# EAGLE schematic combined (EAGLE 9.6.2)
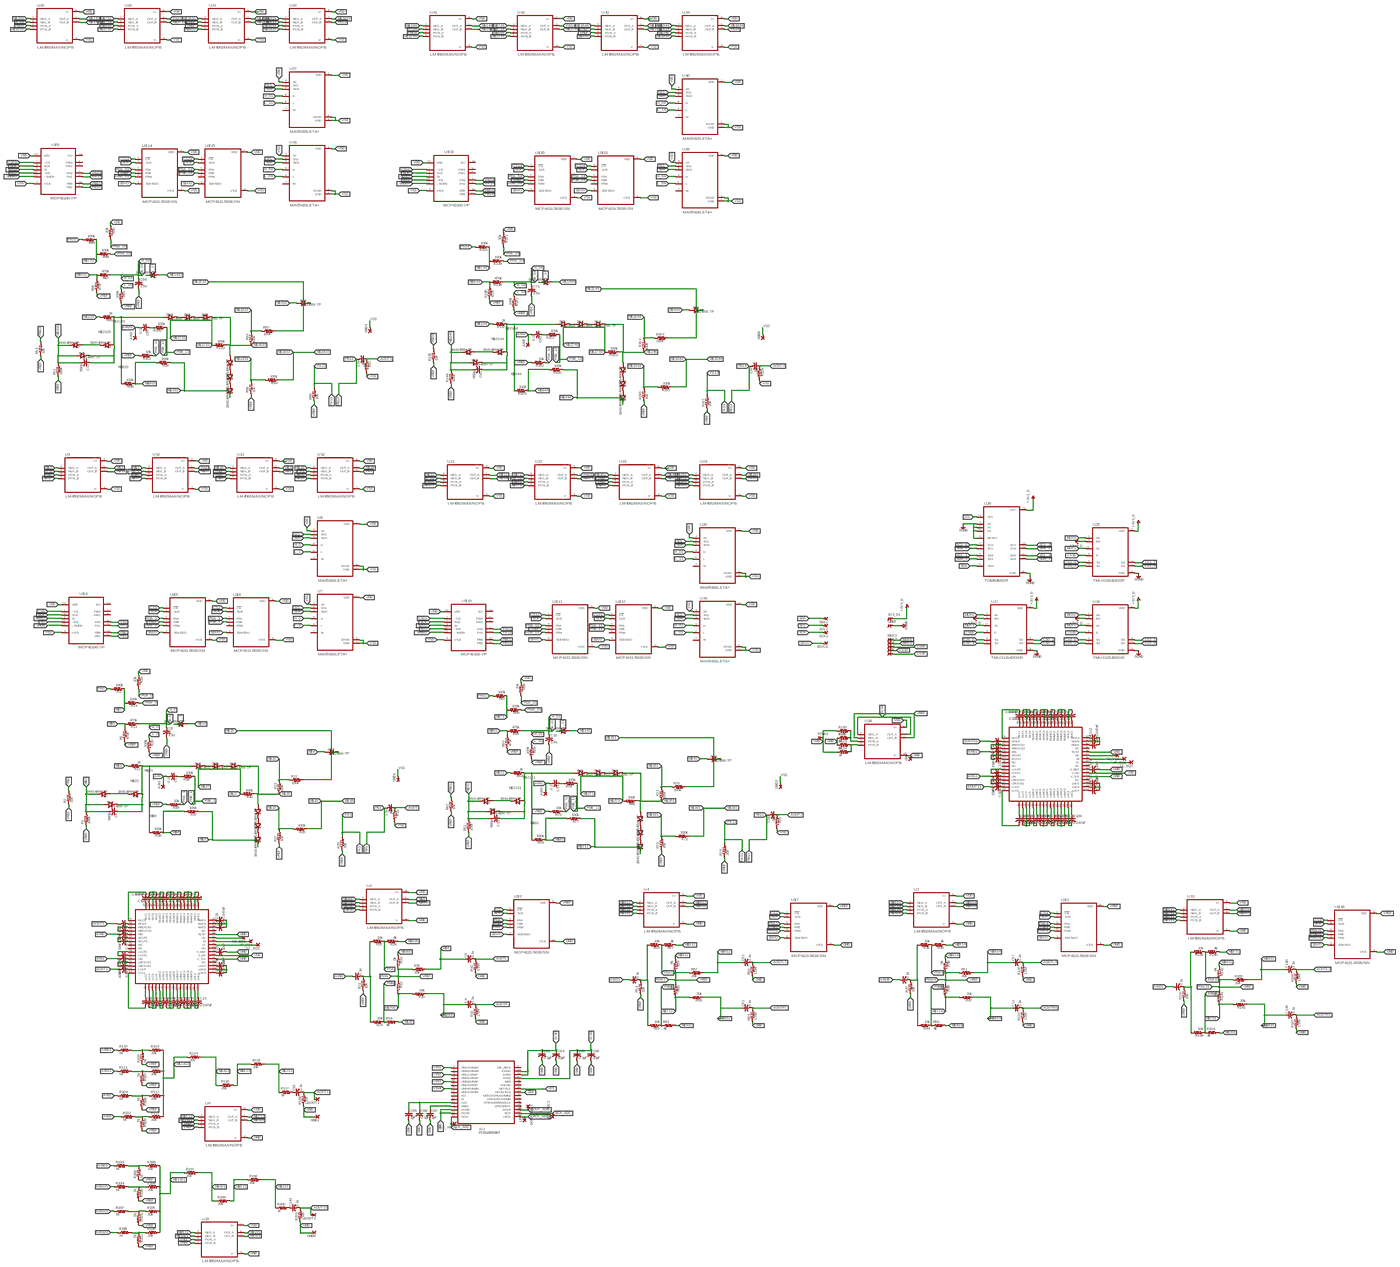
[diagram p0: schematic, sheet 1, overview]
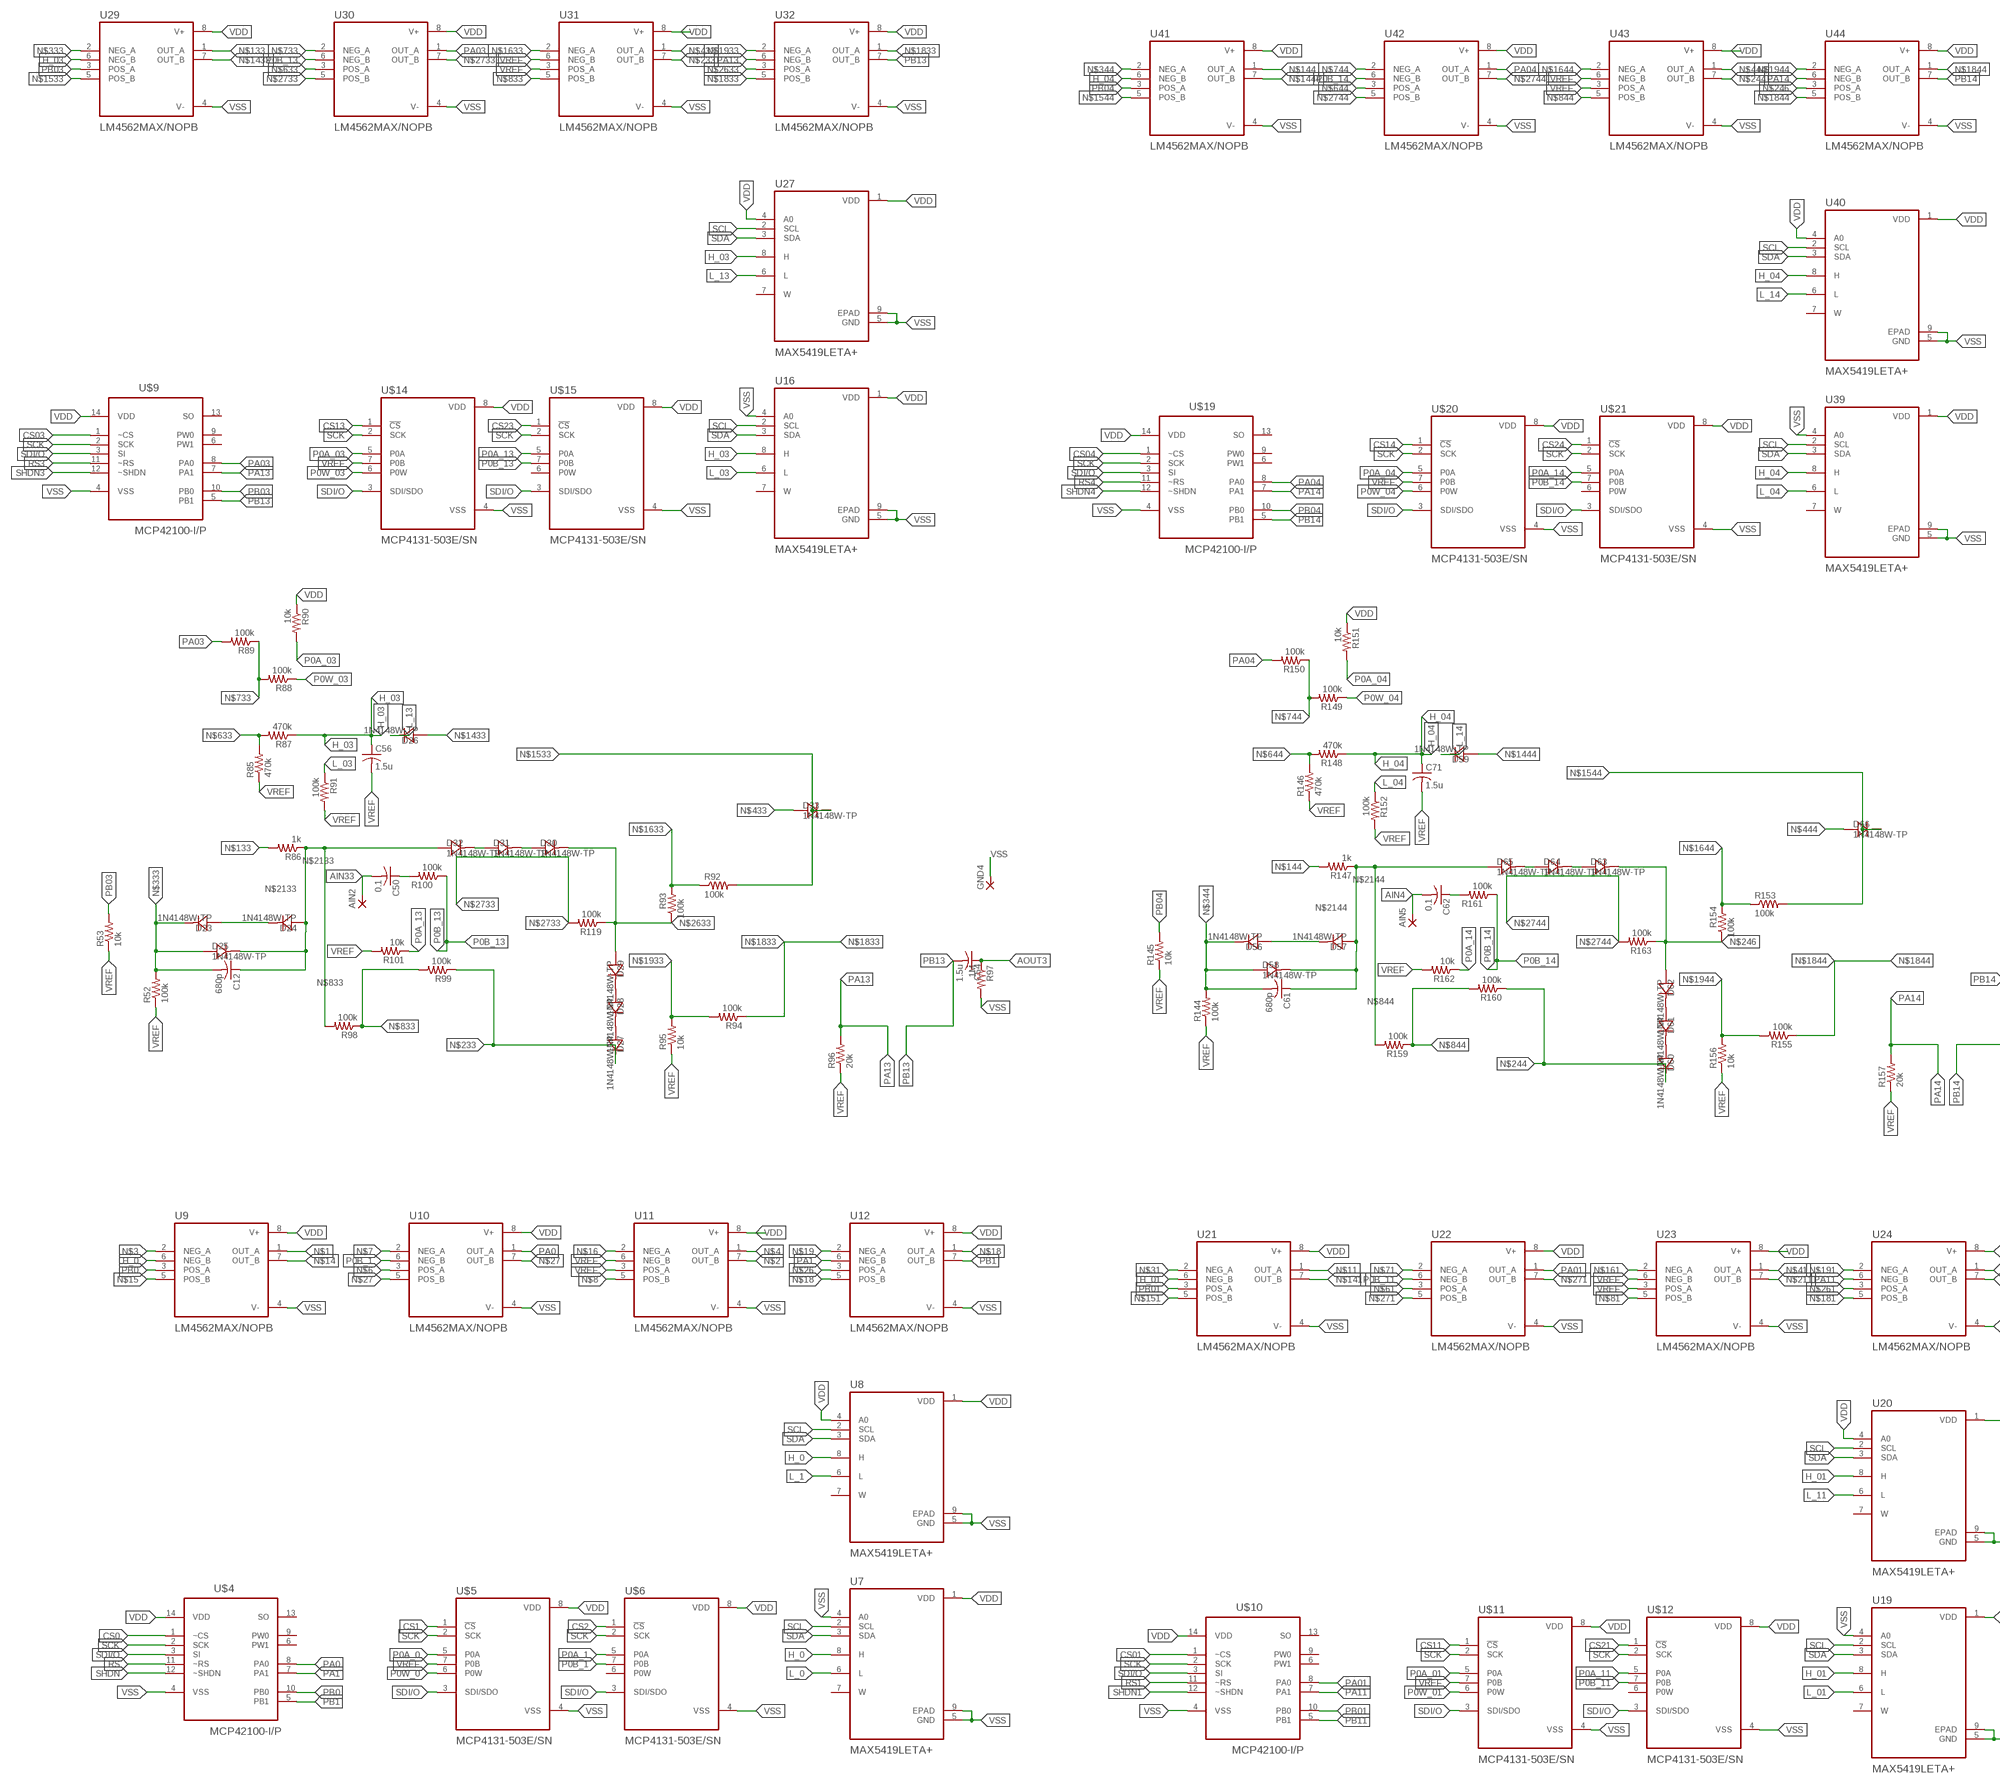
[diagram p1: schematic, sheet 1, part 1 of 4]
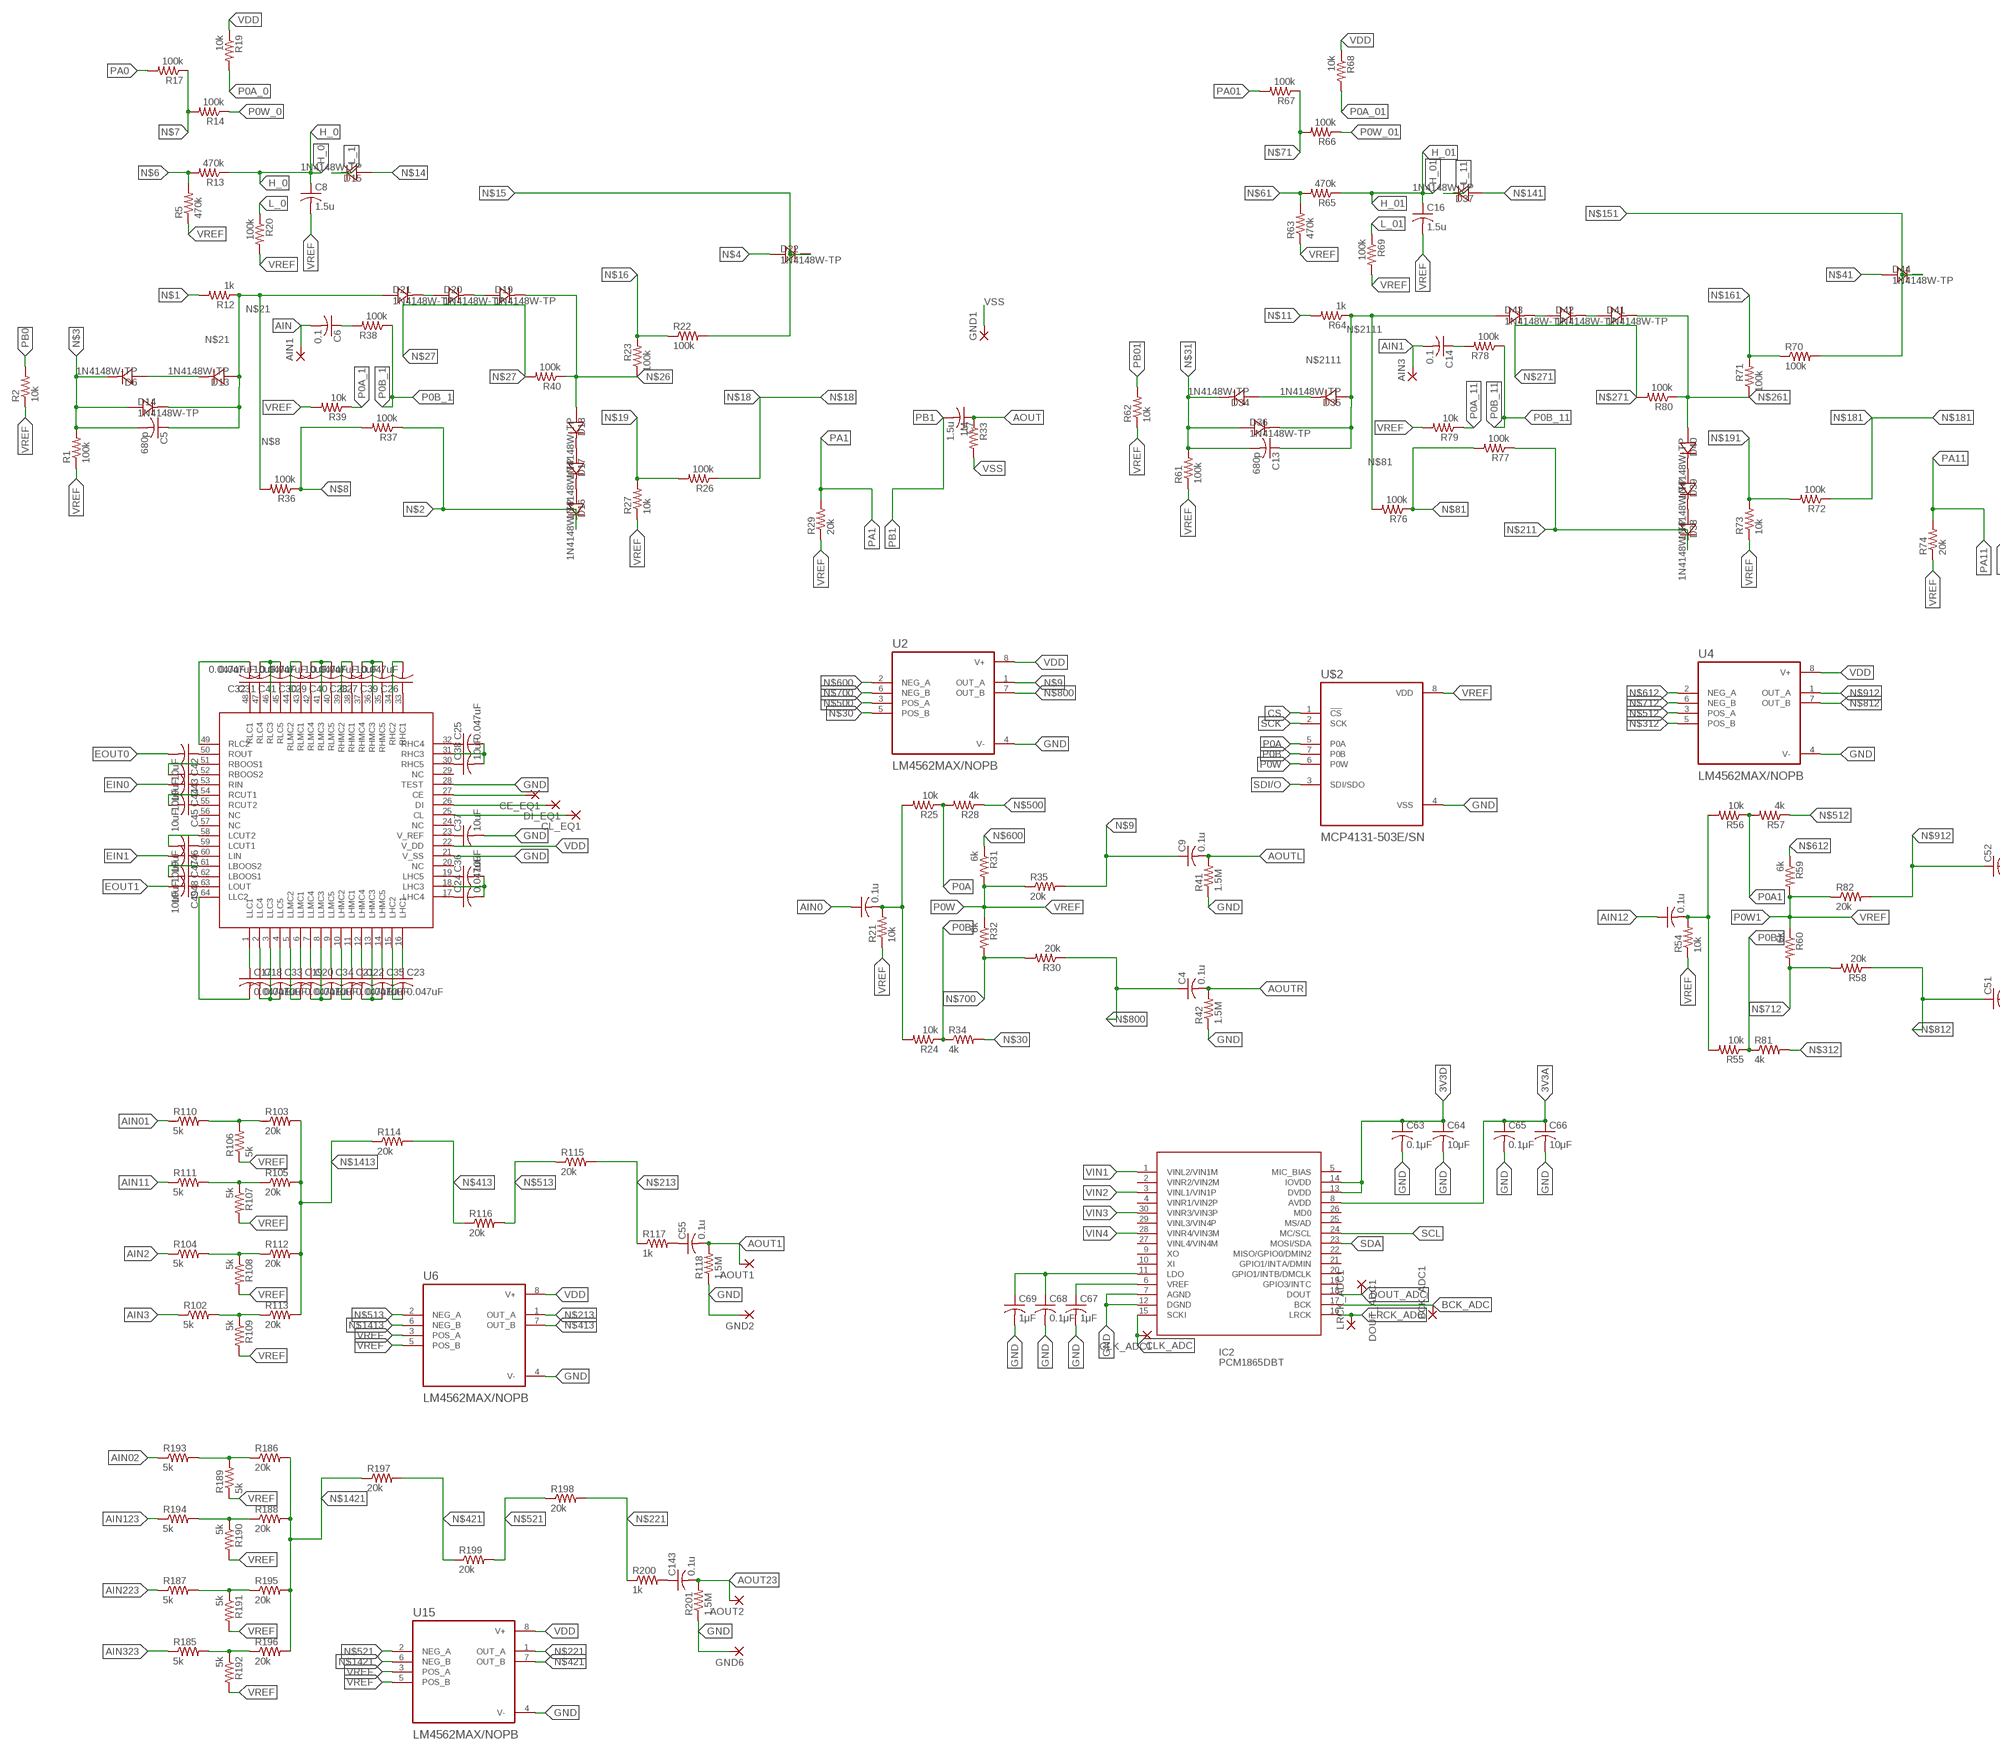
[diagram p2: schematic, sheet 1, part 2 of 4]
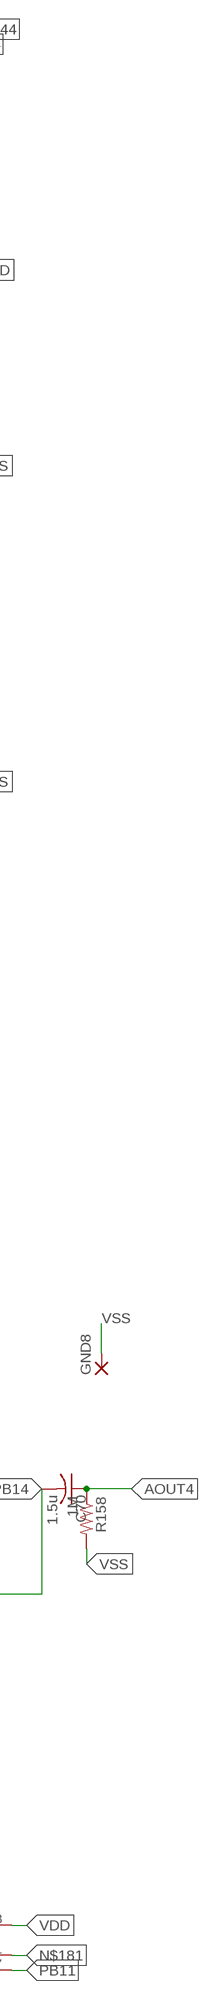
[diagram p3: schematic, sheet 1, part 3 of 4]
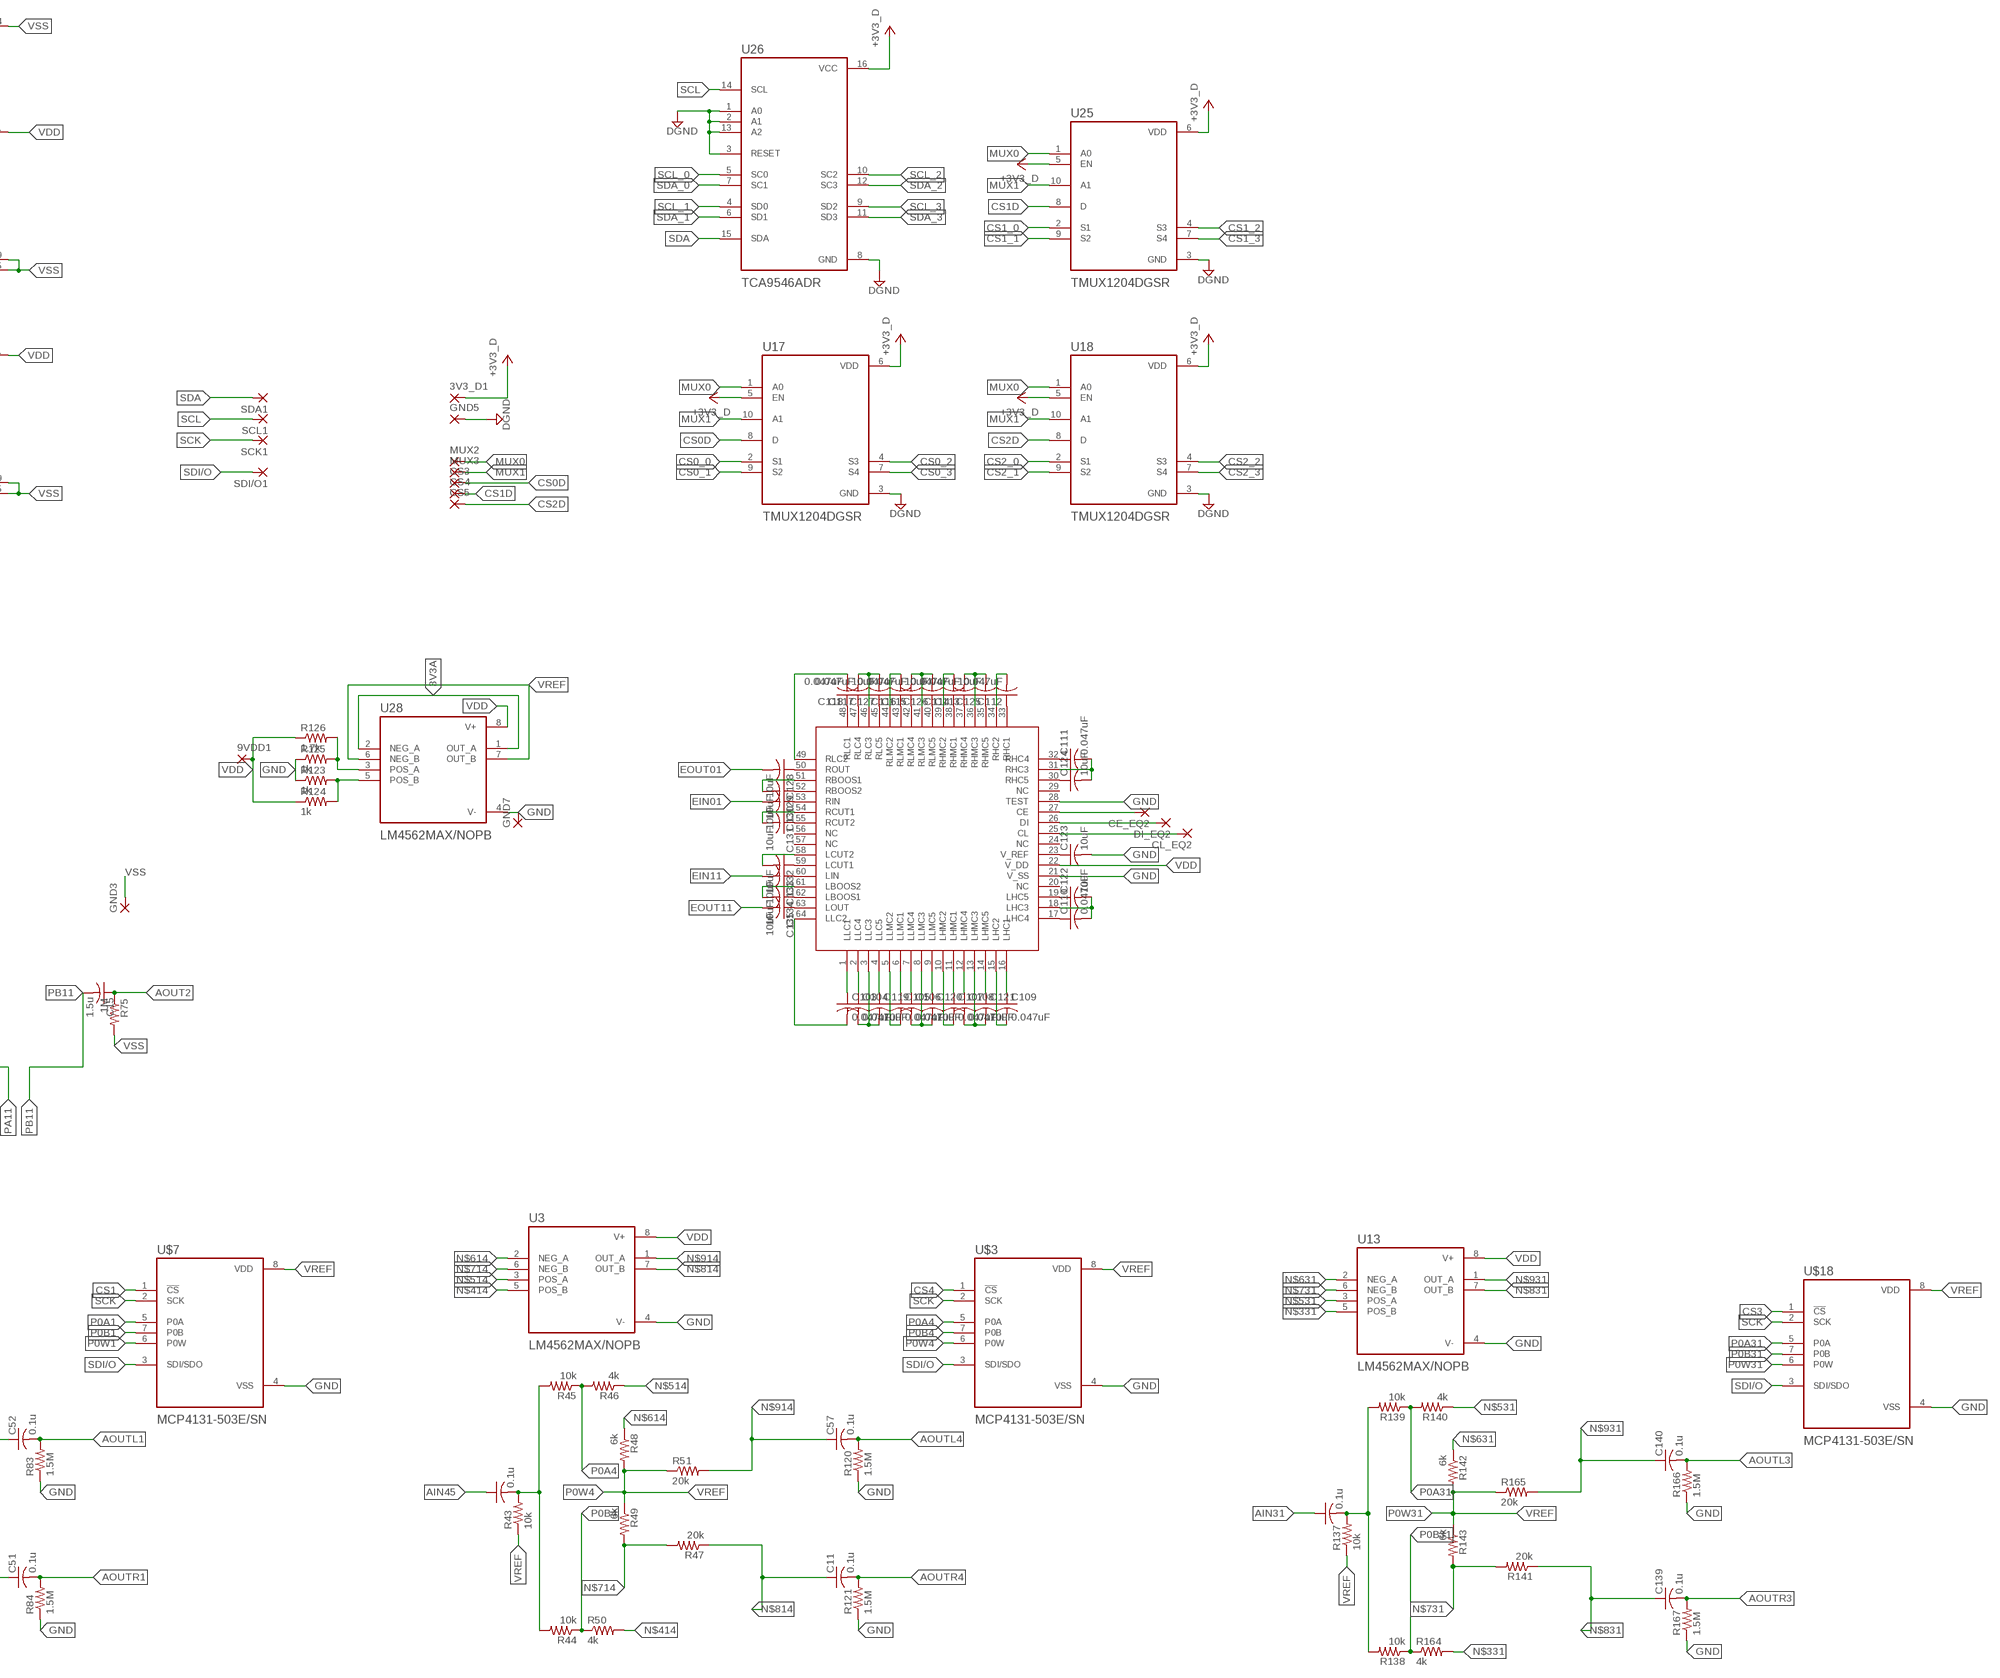
[diagram p4: schematic, sheet 1, part 4 of 4]

## Parts
3V3_D1  SMD2  [SMD1,27-2,54]
9VDD1  SMD2  [SMD1,27-2,54]
AIN1  SMD5  [SMD2,54-5,08]
AIN2  SMD5  [SMD2,54-5,08]
AIN3  SMD5  [SMD2,54-5,08]
AIN5  SMD5  [SMD2,54-5,08]
AOUT1  SMD5  [SMD2,54-5,08]
AOUT2  SMD5  [SMD2,54-5,08]
BCK_ADC1  SMD2  [SMD1,27-2,54]
C4  0.1u  C-USC0402  [C0402]
C5  680p  C-USC0402  [C0402]
C6  0.1  C-USC0402  [C0402]
C7  1.5u  C-USC0402  [C0402]
C8  1.5u  C-USC0402  [C0402]
C9  0.1u  C-USC0402  [C0402]
C10  0.1u  C-USC0402  [C0402]
C11  0.1u  C-USC0402  [C0402]
C12  680p  C-USC0402  [C0402]
C13  680p  C-USC0402  [C0402]
C14  0.1  C-USC0402  [C0402]
C15  1.5u  C-USC0402  [C0402]
C16  1.5u  C-USC0402  [C0402]
C17  0.047uF  C-USC0402  [C0402]
C18  0.047uF  C-USC0402  [C0402]
C19  0.047uF  C-USC0402  [C0402]
C20  0.047uF  C-USC0402  [C0402]
C21  0.047uF  C-USC0402  [C0402]
C22  0.047uF  C-USC0402  [C0402]
C23  0.047uF  C-USC0402  [C0402]
C24  0.047uF  C-USC0402  [C0402]
C25  0.047uF  C-USC0402  [C0402]
C26  0.047uF  C-USC0402  [C0402]
C27  0.047uF  C-USC0402  [C0402]
C28  0.047uF  C-USC0402  [C0402]
C29  0.047uF  C-USC0402  [C0402]
C30  0.047uF  C-USC0402  [C0402]
C31  0.047uF  C-USC0402  [C0402]
C32  0.047uF  C-USC0402  [C0402]
C33  10uF  C-USC0402  [C0402]
C34  10uF  C-USC0402  [C0402]
C35  10uF  C-USC0402  [C0402]
C36  10uF  C-USC0402  [C0402]
C37  10uF  C-USC0402  [C0402]
C38  10uF  C-USC0402  [C0402]
C39  10uF  C-USC0402  [C0402]
C40  10uF  C-USC0402  [C0402]
C41  10uF  C-USC0402  [C0402]
C42  10uF  C-USC0402  [C0402]
C43  10uF  C-USC0402  [C0402]
C44  10uF  C-USC0402  [C0402]
C45  10uF  C-USC0402  [C0402]
C46  10uF  C-USC0402  [C0402]
C47  10uF  C-USC0402  [C0402]
C48  10uF  C-USC0402  [C0402]
C49  10uF  C-USC0402  [C0402]
C50  0.1  C-USC0402  [C0402]
C51  0.1u  C-USC0402  [C0402]
C52  0.1u  C-USC0402  [C0402]
C53  0.1u  C-USC0402  [C0402]
C54  1.5u  C-USC0402  [C0402]
C55  0.1u  C-USC0402  [C0402]
C56  1.5u  C-USC0402  [C0402]
C57  0.1u  C-USC0402  [C0402]
C58  0.1u  C-USC0402  [C0402]
C61  680p  C-USC0402  [C0402]
C62  0.1  C-USC0402  [C0402]
C63  0.1μF  C-USC0402  [C0402]
C64  10μF  C-USC0402  [C0402]
C65  0.1μF  C-USC0402  [C0402]
C66  10μF  C-USC0402  [C0402]
C67  1μF  C-USC0402  [C0402]
C68  0.1μF  C-USC0402  [C0402]
C69  1μF  C-USC0402  [C0402]
C70  1.5u  C-USC0402  [C0402]
C71  1.5u  C-USC0402  [C0402]
C103  0.047uF  C-USC0402  [C0402]
C104  0.047uF  C-USC0402  [C0402]
C105  0.047uF  C-USC0402  [C0402]
C106  0.047uF  C-USC0402  [C0402]
C107  0.047uF  C-USC0402  [C0402]
C108  0.047uF  C-USC0402  [C0402]
C109  0.047uF  C-USC0402  [C0402]
C110  0.047uF  C-USC0402  [C0402]
C111  0.047uF  C-USC0402  [C0402]
C112  0.047uF  C-USC0402  [C0402]
C113  0.047uF  C-USC0402  [C0402]
C114  0.047uF  C-USC0402  [C0402]
C115  0.047uF  C-USC0402  [C0402]
C116  0.047uF  C-USC0402  [C0402]
C117  0.047uF  C-USC0402  [C0402]
C118  0.047uF  C-USC0402  [C0402]
C119  10uF  C-USC0402  [C0402]
C120  10uF  C-USC0402  [C0402]
C121  10uF  C-USC0402  [C0402]
C122  10uF  C-USC0402  [C0402]
C123  10uF  C-USC0402  [C0402]
C124  10uF  C-USC0402  [C0402]
C125  10uF  C-USC0402  [C0402]
C126  10uF  C-USC0402  [C0402]
C127  10uF  C-USC0402  [C0402]
C128  10uF  C-USC0402  [C0402]
C129  10uF  C-USC0402  [C0402]
C130  10uF  C-USC0402  [C0402]
C131  10uF  C-USC0402  [C0402]
C132  10uF  C-USC0402  [C0402]
C133  10uF  C-USC0402  [C0402]
C134  10uF  C-USC0402  [C0402]
C135  10uF  C-USC0402  [C0402]
C139  0.1u  C-USC0402  [C0402]
C140  0.1u  C-USC0402  [C0402]
C141  0.1u  C-USC0402  [C0402]
C143  0.1u  C-USC0402  [C0402]
CE_EQ1  SMD2  [SMD1,27-2,54]
CE_EQ2  SMD2  [SMD1,27-2,54]
CL_EQ1  SMD2  [SMD1,27-2,54]
CL_EQ2  SMD2  [SMD1,27-2,54]
CLK_ADC1  SMD2  [SMD1,27-2,54]
CS3  SMD2  [SMD1,27-2,54]
CS4  SMD2  [SMD1,27-2,54]
CS5  SMD2  [SMD1,27-2,54]
D6  1N4148W-TP  [SOD123]
D13  1N4148W-TP  [SOD123]
D14  1N4148W-TP  [SOD123]
D15  1N4148W-TP  [SOD123]
D16  1N4148W-TP  [SOD123]
D17  1N4148W-TP  [SOD123]
D18  1N4148W-TP  [SOD123]
D19  1N4148W-TP  [SOD123]
D20  1N4148W-TP  [SOD123]
D21  1N4148W-TP  [SOD123]
D22  1N4148W-TP  [SOD123]
D23  1N4148W-TP  [SOD123]
D24  1N4148W-TP  [SOD123]
D25  1N4148W-TP  [SOD123]
D26  1N4148W-TP  [SOD123]
D27  1N4148W-TP  [SOD123]
D28  1N4148W-TP  [SOD123]
D29  1N4148W-TP  [SOD123]
D30  1N4148W-TP  [SOD123]
D31  1N4148W-TP  [SOD123]
D32  1N4148W-TP  [SOD123]
D33  1N4148W-TP  [SOD123]
D34  1N4148W-TP  [SOD123]
D35  1N4148W-TP  [SOD123]
D36  1N4148W-TP  [SOD123]
D37  1N4148W-TP  [SOD123]
D38  1N4148W-TP  [SOD123]
D39  1N4148W-TP  [SOD123]
D40  1N4148W-TP  [SOD123]
D41  1N4148W-TP  [SOD123]
D42  1N4148W-TP  [SOD123]
D43  1N4148W-TP  [SOD123]
D44  1N4148W-TP  [SOD123]
D56  1N4148W-TP  [SOD123]
D57  1N4148W-TP  [SOD123]
D58  1N4148W-TP  [SOD123]
D59  1N4148W-TP  [SOD123]
D60  1N4148W-TP  [SOD123]
D61  1N4148W-TP  [SOD123]
D62  1N4148W-TP  [SOD123]
D63  1N4148W-TP  [SOD123]
D64  1N4148W-TP  [SOD123]
D65  1N4148W-TP  [SOD123]
D66  1N4148W-TP  [SOD123]
DI_EQ1  SMD2  [SMD1,27-2,54]
DI_EQ2  SMD2  [SMD1,27-2,54]
DOUT_ADC1  SMD2  [SMD1,27-2,54]
GND1  SMD5  [SMD2,54-5,08]
GND2  SMD5  [SMD2,54-5,08]
GND3  SMD5  [SMD2,54-5,08]
GND4  SMD5  [SMD2,54-5,08]
GND5  SMD2  [SMD1,27-2,54]
GND6  SMD5  [SMD2,54-5,08]
GND7  SMD2  [SMD1,27-2,54]
GND8  SMD5  [SMD2,54-5,08]
IC2  PCM1865DBT  [TSSOP-30]
LRCK_ADC1  SMD2  [SMD1,27-2,54]
MUX2  SMD2  [SMD1,27-2,54]
MUX3  SMD2  [SMD1,27-2,54]
R1  100k  R-US_R0402  [R0402]
R2  10k  R-US_R0402  [R0402]
R5  470k  R-US_R0402  [R0402]
R12  1k  R-US_R0402  [R0402]
R13  470k  R-US_R0402  [R0402]
R14  100k  R-US_R0402  [R0402]
R17  100k  R-US_R0402  [R0402]
R19  10k  R-US_R0402  [R0402]
R20  100k  R-US_R0402  [R0402]
R21  10k  R-US_R0402  [R0402]
R22  100k  R-US_R0402  [R0402]
R23  100k  R-US_R0402  [R0402]
R24  10k  R-US_R0402  [R0402]
R25  10k  R-US_R0402  [R0402]
R26  100k  R-US_R0402  [R0402]
R27  10k  R-US_R0402  [R0402]
R28  4k  R-US_R0402  [R0402]
R29  20k  R-US_R0402  [R0402]
R30  20k  R-US_R0402  [R0402]
R31  6k  R-US_R0402  [R0402]
R32  6k  R-US_R0402  [R0402]
R33  1M  R-US_R0402  [R0402]
R34  4k  R-US_R0402  [R0402]
R35  20k  R-US_R0402  [R0402]
R36  100k  R-US_R0402  [R0402]
R37  100k  R-US_R0402  [R0402]
R38  100k  R-US_R0402  [R0402]
R39  10k  R-US_R0402  [R0402]
R40  100k  R-US_R0402  [R0402]
R41  1.5M  R-US_R0402  [R0402]
R42  1.5M  R-US_R0402  [R0402]
R43  10k  R-US_R0402  [R0402]
R44  10k  R-US_R0402  [R0402]
R45  10k  R-US_R0402  [R0402]
R46  4k  R-US_R0402  [R0402]
R47  20k  R-US_R0402  [R0402]
R48  6k  R-US_R0402  [R0402]
R49  6k  R-US_R0402  [R0402]
R50  4k  R-US_R0402  [R0402]
R51  20k  R-US_R0402  [R0402]
R52  100k  R-US_R0402  [R0402]
R53  10k  R-US_R0402  [R0402]
R54  10k  R-US_R0402  [R0402]
R55  10k  R-US_R0402  [R0402]
R56  10k  R-US_R0402  [R0402]
R57  4k  R-US_R0402  [R0402]
R58  20k  R-US_R0402  [R0402]
R59  6k  R-US_R0402  [R0402]
R60  6k  R-US_R0402  [R0402]
R61  100k  R-US_R0402  [R0402]
R62  10k  R-US_R0402  [R0402]
R63  470k  R-US_R0402  [R0402]
R64  1k  R-US_R0402  [R0402]
R65  470k  R-US_R0402  [R0402]
R66  100k  R-US_R0402  [R0402]
R67  100k  R-US_R0402  [R0402]
R68  10k  R-US_R0402  [R0402]
R69  100k  R-US_R0402  [R0402]
R70  100k  R-US_R0402  [R0402]
R71  100k  R-US_R0402  [R0402]
R72  100k  R-US_R0402  [R0402]
R73  10k  R-US_R0402  [R0402]
R74  20k  R-US_R0402  [R0402]
R75  1M  R-US_R0402  [R0402]
R76  100k  R-US_R0402  [R0402]
R77  100k  R-US_R0402  [R0402]
R78  100k  R-US_R0402  [R0402]
R79  10k  R-US_R0402  [R0402]
R80  100k  R-US_R0402  [R0402]
R81  4k  R-US_R0402  [R0402]
R82  20k  R-US_R0402  [R0402]
R83  1.5M  R-US_R0402  [R0402]
R84  1.5M  R-US_R0402  [R0402]
R85  470k  R-US_R0402  [R0402]
R86  1k  R-US_R0402  [R0402]
R87  470k  R-US_R0402  [R0402]
R88  100k  R-US_R0402  [R0402]
R89  100k  R-US_R0402  [R0402]
R90  10k  R-US_R0402  [R0402]
R91  100k  R-US_R0402  [R0402]
R92  100k  R-US_R0402  [R0402]
R93  100k  R-US_R0402  [R0402]
R94  100k  R-US_R0402  [R0402]
R95  10k  R-US_R0402  [R0402]
R96  20k  R-US_R0402  [R0402]
R97  1M  R-US_R0402  [R0402]
R98  100k  R-US_R0402  [R0402]
R99  100k  R-US_R0402  [R0402]
R100  100k  R-US_R0402  [R0402]
R101  10k  R-US_R0402  [R0402]
R102  5k  R-US_R0402  [R0402]
R103  20k  R-US_R0402  [R0402]
R104  5k  R-US_R0402  [R0402]
R105  20k  R-US_R0402  [R0402]
R106  5k  R-US_R0402  [R0402]
R107  5k  R-US_R0402  [R0402]
R108  5k  R-US_R0402  [R0402]
R109  5k  R-US_R0402  [R0402]
R110  5k  R-US_R0402  [R0402]
R111  5k  R-US_R0402  [R0402]
R112  20k  R-US_R0402  [R0402]
R113  20k  R-US_R0402  [R0402]
R114  20k  R-US_R0402  [R0402]
R115  20k  R-US_R0402  [R0402]
R116  20k  R-US_R0402  [R0402]
R117  1k  R-US_R0402  [R0402]
R118  1.5M  R-US_R0402  [R0402]
R119  100k  R-US_R0402  [R0402]
R120  1.5M  R-US_R0402  [R0402]
R121  1.5M  R-US_R0402  [R0402]
R123  1k  R-US_R0402  [R0402]
R124  1k  R-US_R0402  [R0402]
R125  1k  R-US_R0402  [R0402]
R126  1.7k  R-US_R0402  [R0402]
R137  10k  R-US_R0402  [R0402]
R138  10k  R-US_R0402  [R0402]
R139  10k  R-US_R0402  [R0402]
R140  4k  R-US_R0402  [R0402]
R141  20k  R-US_R0402  [R0402]
R142  6k  R-US_R0402  [R0402]
R143  6k  R-US_R0402  [R0402]
R144  100k  R-US_R0402  [R0402]
R145  10k  R-US_R0402  [R0402]
R146  470k  R-US_R0402  [R0402]
R147  1k  R-US_R0402  [R0402]
R148  470k  R-US_R0402  [R0402]
R149  100k  R-US_R0402  [R0402]
R150  100k  R-US_R0402  [R0402]
R151  10k  R-US_R0402  [R0402]
R152  100k  R-US_R0402  [R0402]
R153  100k  R-US_R0402  [R0402]
R154  100k  R-US_R0402  [R0402]
R155  100k  R-US_R0402  [R0402]
R156  10k  R-US_R0402  [R0402]
R157  20k  R-US_R0402  [R0402]
R158  1M  R-US_R0402  [R0402]
R159  100k  R-US_R0402  [R0402]
R160  100k  R-US_R0402  [R0402]
R161  100k  R-US_R0402  [R0402]
R162  10k  R-US_R0402  [R0402]
R163  100k  R-US_R0402  [R0402]
R164  4k  R-US_R0402  [R0402]
R165  20k  R-US_R0402  [R0402]
R166  1.5M  R-US_R0402  [R0402]
R167  1.5M  R-US_R0402  [R0402]
R185  5k  R-US_R0402  [R0402]
R186  20k  R-US_R0402  [R0402]
R187  5k  R-US_R0402  [R0402]
R188  20k  R-US_R0402  [R0402]
R189  5k  R-US_R0402  [R0402]
R190  5k  R-US_R0402  [R0402]
R191  5k  R-US_R0402  [R0402]
R192  5k  R-US_R0402  [R0402]
R193  5k  R-US_R0402  [R0402]
R194  5k  R-US_R0402  [R0402]
R195  20k  R-US_R0402  [R0402]
R196  20k  R-US_R0402  [R0402]
R197  20k  R-US_R0402  [R0402]
R198  20k  R-US_R0402  [R0402]
R199  20k  R-US_R0402  [R0402]
R200  1k  R-US_R0402  [R0402]
R201  1.5M  R-US_R0402  [R0402]
SCK1  SMD2  [SMD1,27-2,54]
SCL1  SMD2  [SMD1,27-2,54]
SDA1  SMD2  [SMD1,27-2,54]
SDI/O1  SMD2  [SMD1,27-2,54]
U2  LM4562MAX/NOPB  [SOIC127P599X175-8N]
U3  LM4562MAX/NOPB  [SOIC127P599X175-8N]
U4  LM4562MAX/NOPB  [SOIC127P599X175-8N]
U6  LM4562MAX/NOPB  [SOIC127P599X175-8N]
U7  MAX5419LETA+  [SON65P300X300X80-9N]
U8  MAX5419LETA+  [SON65P300X300X80-9N]
U9  LM4562MAX/NOPB  [SOIC127P599X175-8N]
U10  LM4562MAX/NOPB  [SOIC127P599X175-8N]
U11  LM4562MAX/NOPB  [SOIC127P599X175-8N]
U12  LM4562MAX/NOPB  [SOIC127P599X175-8N]
U13  LM4562MAX/NOPB  [SOIC127P599X175-8N]
U15  LM4562MAX/NOPB  [SOIC127P599X175-8N]
U16  MAX5419LETA+  [SON65P300X300X80-9N]
U17  TMUX1204DGSR  [SOP50P490X110-10N]
U18  TMUX1204DGSR  [SOP50P490X110-10N]
U19  MAX5419LETA+  [SON65P300X300X80-9N]
U20  MAX5419LETA+  [SON65P300X300X80-9N]
U21  LM4562MAX/NOPB  [SOIC127P599X175-8N]
U22  LM4562MAX/NOPB  [SOIC127P599X175-8N]
U23  LM4562MAX/NOPB  [SOIC127P599X175-8N]
U24  LM4562MAX/NOPB  [SOIC127P599X175-8N]
U25  TMUX1204DGSR  [SOP50P490X110-10N]
U26  TCA9546ADR  [SOIC127P600X175-16N]
U27  MAX5419LETA+  [SON65P300X300X80-9N]
U28  LM4562MAX/NOPB  [SOIC127P599X175-8N]
U29  LM4562MAX/NOPB  [SOIC127P599X175-8N]
U30  LM4562MAX/NOPB  [SOIC127P599X175-8N]
U31  LM4562MAX/NOPB  [SOIC127P599X175-8N]
U32  LM4562MAX/NOPB  [SOIC127P599X175-8N]
U39  MAX5419LETA+  [SON65P300X300X80-9N]
U40  MAX5419LETA+  [SON65P300X300X80-9N]
U41  LM4562MAX/NOPB  [SOIC127P599X175-8N]
U42  LM4562MAX/NOPB  [SOIC127P599X175-8N]
U43  LM4562MAX/NOPB  [SOIC127P599X175-8N]
U44  LM4562MAX/NOPB  [SOIC127P599X175-8N]
U$2  MCP4131-503E/SN  [SOIC127P599X175-8N]
U$3  MCP4131-503E/SN  [SOIC127P599X175-8N]
U$4  MCP42100-I/P  [DIP254P762X432-14]
U$5  MCP4131-503E/SN  [SOIC127P599X175-8N]
U$6  MCP4131-503E/SN  [SOIC127P599X175-8N]
U$7  MCP4131-503E/SN  [SOIC127P599X175-8N]
U$9  MCP42100-I/P  [DIP254P762X432-14]
U$10  MCP42100-I/P  [DIP254P762X432-14]
U$11  MCP4131-503E/SN  [SOIC127P599X175-8N]
U$12  MCP4131-503E/SN  [SOIC127P599X175-8N]
U$13  LC75281E  [QFP80P1720X1720X270-64N]
U$14  MCP4131-503E/SN  [SOIC127P599X175-8N]
U$15  MCP4131-503E/SN  [SOIC127P599X175-8N]
U$16  LC75281E  [QFP80P1720X1720X270-64N]
U$18  MCP4131-503E/SN  [SOIC127P599X175-8N]
U$19  MCP42100-I/P  [DIP254P762X432-14]
U$20  MCP4131-503E/SN  [SOIC127P599X175-8N]
U$21  MCP4131-503E/SN  [SOIC127P599X175-8N]

## Nets
3V3A: C65.1 C66.1 IC2.8(AVDD) U28.1(OUT_A) U28.2(NEG_A)
3V3D: C63.1 C64.1 IC2.13(DVDD) IC2.14(IOVDD)
+3V3: 3V3_D1.1(P) U17.5(EN) U17.6(VDD) U18.5(EN) U18.6(VDD) U25.5(EN) U25.6(VDD) U26.16(VCC) ; supply symbol labelled +3V3_D
AIN: AIN1.1(P) C6.2
AIN0: C10.1
AIN1: AIN3.1(P) C14.2
AIN01: R110.1
AIN2: R104.1
AIN02: R193.1
AIN3: R102.1
AIN4: AIN5.1(P) C62.2
AIN11: R111.1
AIN12: C53.1
AIN31: C141.1
AIN33: AIN2.1(P) C50.2
AIN45: C58.1
AIN123: R194.1
AIN223: R187.1
AIN323: R185.1
AOUT: C7.1 R33.1
AOUT1: AOUT1.1(P) C55.2 R118.2
AOUT2: C15.1 R75.1
AOUT3: C54.1 R97.1
AOUT4: C70.1 R158.1
AOUT23: AOUT2.1(P) C143.2 R201.2
AOUTL: C9.2 R41.2
AOUTL1: C52.2 R83.2
AOUTL3: C140.2 R166.2
AOUTL4: C57.2 R120.2
AOUTR: C4.2 R42.2
AOUTR1: C51.2 R84.2
AOUTR3: C139.2 R167.2
AOUTR4: C11.2 R121.2
BCK_ADC: BCK_ADC1.1(P) IC2.17(BCK)
CLK_ADC: CLK_ADC1.1(P) IC2.15(SCKI)
CS: U$2.1(!CS)
CS0: U$4.1(~CS)
CS0_0: U17.2(S1)
CS0_1: U17.9(S2)
CS0_2: U17.4(S3)
CS0_3: U17.7(S4)
CS0D: CS3.1(P) U17.8(D)
CS1: U$5.1(!CS) U$7.1(!CS)
CS01: U$10.1(~CS)
CS1_0: U25.2(S1)
CS1_1: U25.9(S2)
CS1_2: U25.4(S3)
CS1_3: U25.7(S4)
CS1D: CS4.1(P) U25.8(D)
CS2: U$6.1(!CS)
CS2_0: U18.2(S1)
CS2_1: U18.9(S2)
CS2_2: U18.4(S3)
CS2_3: U18.7(S4)
CS2D: CS5.1(P) U18.8(D)
CS03: U$9.1(~CS)
CS3: U$18.1(!CS)
CS04: U$19.1(~CS)
CS4: U$3.1(!CS)
CS11: U$11.1(!CS)
CS13: U$14.1(!CS)
CS14: U$20.1(!CS)
CS21: U$12.1(!CS)
CS23: U$15.1(!CS)
CS24: U$21.1(!CS)
DGND: GND5.1(P) U17.3(GND) U18.3(GND) U25.3(GND) U26.1(A0) U26.2(A1) U26.3(RESET) U26.8(GND) U26.13(A2)
DOUT_ADC: DOUT_ADC1.1(P) IC2.18(DOUT)
EIN0 [ANALOG]: C44.2
EIN1 [ANALOG]: C47.2
EIN01: C130.2
EIN11: C133.2
EOUT0 [ANALOG]: C42.2
EOUT1 [ANALOG]: C49.2
EOUT01: C128.2
EOUT11: C135.2
EQ1_CE1: CE_EQ1.1(P) U$13.27(CE)
EQ1_CE2: CE_EQ2.1(P) U$16.27(CE)
EQ1_CL1: CL_EQ1.1(P) U$13.25(CL)
EQ1_CL2: CL_EQ2.1(P) U$16.25(CL)
EQ1_DI1: DI_EQ1.1(P) U$13.26(DI)
EQ1_DI2: DI_EQ2.1(P) U$16.26(DI)
GND: C37.2 C63.2 C64.2 C65.2 C66.2 C67.2 C68.2 C69.2 C123.2 GND2.1(P) GND6.1(P) GND7.1(P) IC2.7(AGND) IC2.12(DGND) R41.1 R42.1 R83.1 R84.1 R118.1 R120.1 R121.1 R123.1 R125.1 R166.1 R167.1 R201.1 U2.4(V-) U3.4(V-) U4.4(V-) U6.4(V-) U13.4(V-) U15.4(V-) U28.4(V-) U$2.4(VSS) U$3.4(VSS) U$7.4(VSS) U$13.21(V_SS) U$13.28(TEST) U$16.21(V_SS) U$16.28(TEST) U$18.4(VSS)
H_0: C8.1 R13.1 U7.8(H) U8.8(H) U9.6(NEG_B)
H_01: C16.1 R65.1 U19.8(H) U20.8(H) U21.6(NEG_B)
H_03: C56.1 R87.1 U16.8(H) U27.8(H) U29.6(NEG_B)
H_04: C71.1 R148.1 U39.8(H) U40.8(H) U41.6(NEG_B)
L_0: R20.1 U7.6(L)
L_1: D15.C U8.6(L)
L_01: R69.1 U19.6(L)
L_03: R91.1 U16.6(L)
L_04: R152.1 U39.6(L)
L_11: D37.C U20.6(L)
L_13: D26.C U27.6(L)
L_14: D59.C U40.6(L)
LRCK_ADC: IC2.16(LRCK) LRCK_ADC1.1(P)
MUX0: MUX2.1(P) U17.1(A0) U18.1(A0) U25.1(A0)
MUX1: MUX3.1(P) U17.10(A1) U18.10(A1) U25.10(A1)
N$1: D6.A D13.C R12.2 U9.1(OUT_A)
N$2: D16.C D17.A D18.C R37.1 U11.7(OUT_B)
N$3: C5.2 D6.C D14.A D16.A D17.C R1.2 U9.2(NEG_A)
N$4: C6.1 D22.A R38.2 U11.1(OUT_A)
N$5: D20.A D21.C
N$6: D19.A D20.C R5.2 R13.2 U10.3(POS_A)
N$7: R14.2 R17.1 U10.2(NEG_A)
N$8: R36.1 R37.2 U11.5(POS_B)
N$9: C9.1 R35.2 U2.1(OUT_A)
N$10: C10.2 R21.2 R24.2 R25.2
N$11: R64.2 U21.1(OUT_A)
N$13: D34.A D35.C
N$14: D15.A U9.7(OUT_B)
N$15: D22.C R22.2 U9.5(POS_B)
N$16: R22.1 R23.2 U11.2(NEG_A)
N$17: D42.A D43.C
N$18: R26.1 U12.1(OUT_A) U12.5(POS_B)
N$19: R26.2 R27.2 U12.2(NEG_A)
N$20: C58.2 R43.2 R44.2 R45.2
N$21: C5.1 D13.A D14.C D21.A R12.1 R36.2
N$22 [ANALOG]: C19.1 U$13.6(LLMC1)
N$23 [ANALOG]: C20.1 U$13.7(LLMC4)
N$26: D18.A D19.C R23.1 R40.1 U12.3(POS_A)
N$27: R40.2 U10.5(POS_B) U10.7(OUT_B)
N$28 [ANALOG]: C23.1 U$13.16(LHC1)
N$29 [ANALOG]: C24.1 U$13.17(LHC4)
N$30: R34.2 U2.5(POS_B)
N$31: C13.2 D34.C D36.A R61.2 U21.2(NEG_A)
N$33 [ANALOG]: C25.1 U$13.32(RHC4)
N$34 [ANALOG]: C26.1 U$13.33(RHC1)
N$35 [ANALOG]: C27.1 U$13.37(RHMC4)
N$36 [ANALOG]: C28.1 U$13.38(RHMC1)
N$37 [ANALOG]: C29.1 U$13.42(RLMC4)
N$38 [ANALOG]: C30.1 U$13.43(RLMC1)
N$39 [ANALOG]: C31.1 U$13.47(RLC4)
N$40 [ANALOG]: C32.1 U$13.48(RLC1)
N$41: D44.A U23.1(OUT_A)
N$42 [ANALOG]: C18.2 C33.2 U$13.3(LLC3)
N$43 [ANALOG]: C33.1 U$13.4(LLC5)
N$44 [ANALOG]: C34.1 U$13.9(LLMC5)
N$45 [ANALOG]: C35.1 U$13.14(LHMC5)
N$46 [ANALOG]: C36.1 U$13.19(LHC5)
N$47 [ANALOG]: C37.1 U$13.23(V_REF)
N$48 [ANALOG]: C38.1 U$13.30(RHC5)
N$49 [ANALOG]: C39.1 U$13.35(RHMC5)
N$50 [ANALOG]: C40.1 U$13.40(RLMC5)
N$51 [ANALOG]: C41.1 U$13.45(RLC5)
N$52 [ANALOG]: C42.1 U$13.50(ROUT)
N$53 [ANALOG]: C43.1 U$13.52(RBOOS2)
N$54 [ANALOG]: C44.1 U$13.53(RIN)
N$55 [ANALOG]: C45.1 U$13.55(RCUT2)
N$56 [ANALOG]: C46.1 U$13.59(LCUT1)
N$57 [ANALOG]: C47.1 U$13.60(LIN)
N$58 [ANALOG]: C48.1 U$13.62(LBOOS1)
N$59 [ANALOG]: C49.1 U$13.63(LOUT)
N$60 [ANALOG]: C19.2 U$13.5(LLMC2)
N$61: R63.2 R65.2 U22.3(POS_A)
N$62 [ANALOG]: C21.2 U$13.10(LHMC2)
N$63 [ANALOG]: C22.2 C35.2 U$13.13(LHMC3)
N$64 [ANALOG]: C23.2 U$13.15(LHC2)
N$65 [ANALOG]: C24.2 C36.2 U$13.18(LHC3)
N$66 [ANALOG]: C25.2 C38.2 U$13.31(RHC3)
N$67 [ANALOG]: C26.2 U$13.34(RHC2)
N$68 [ANALOG]: C27.2 C39.2 U$13.36(RHMC3)
N$69 [ANALOG]: C28.2 U$13.39(RHMC2)
N$70 [ANALOG]: C29.2 C40.2 U$13.41(RLMC3)
N$71: R66.2 R67.1 U22.2(NEG_A)
N$72 [ANALOG]: C31.2 C41.2 U$13.46(RLC3)
N$73 [ANALOG]: C32.2 U$13.49(RLC2)
N$74 [ANALOG]: C43.2 U$13.51(RBOOS1)
N$75 [ANALOG]: C45.2 U$13.54(RCUT1)
N$76 [ANALOG]: C46.2 U$13.58(LCUT2)
N$77 [ANALOG]: C48.2 U$13.61(LBOOS2)
N$78 [ANALOG]: C18.1 U$13.2(LLC4)
N$80: C55.1 R117.2
N$81: R76.1 R77.2 U23.5(POS_B)
N$82: R103.1 R106.2 R110.2
N$83: R102.2 R109.1 R113.1
N$84: R104.2 R108.1 R112.1
N$85: R105.1 R107.1 R111.2
N$86: D23.A D24.C
N$87: D28.A D29.C
N$88: C67.1 IC2.6(VREF)
N$89: C68.1 C69.1 IC2.11(LDO)
N$90: D27.A D28.C
N$91: C50.1 R100.2
N$92: R125.2 R126.2 U28.3(POS_A)
N$93: R123.2 R124.2 U28.5(POS_B)
N$94: D31.A D32.C
N$95: D30.A D31.C
N$99: C103.1 U$16.1(LLC1)
N$100: C105.1 U$16.6(LLMC1)
N$101: C106.1 U$16.7(LLMC4)
N$102: D56.A D57.C
N$103: D61.A D62.C
N$104: D60.A D61.C
N$105: C62.1 R161.2
N$106: D64.A D65.C
N$107: D63.A D64.C
N$108: C107.1 U$16.11(LHMC1)
N$109: C108.1 U$16.12(LHMC4)
N$110: C109.1 U$16.16(LHC1)
N$111: C110.1 U$16.17(LHC4)
N$112: C111.1 U$16.32(RHC4)
N$113: C112.1 U$16.33(RHC1)
N$114: C113.1 U$16.37(RHMC4)
N$115: C114.1 U$16.38(RHMC1)
N$116: C115.1 U$16.42(RLMC4)
N$117: C116.1 U$16.43(RLMC1)
N$118: C117.1 U$16.47(RLC4)
N$119: C118.1 U$16.48(RLC1)
N$120: C103.2 U$16.64(LLC2)
N$121: C104.2 C119.2 U$16.3(LLC3)
N$122: C119.1 U$16.4(LLC5)
N$124: C120.1 U$16.9(LLMC5)
N$131: C121.1 U$16.14(LHMC5)
N$132: C122.1 U$16.19(LHC5)
N$133: R86.2 U29.1(OUT_A)
N$135: C123.1 U$16.23(V_REF)
N$136: C124.1 U$16.30(RHC5)
N$137: C125.1 U$16.35(RHMC5)
N$138: C126.1 U$16.40(RLMC5)
N$139: C127.1 U$16.45(RLC5)
N$140: C128.1 U$16.50(ROUT)
N$141: D37.A U21.7(OUT_B)
N$142: D39.A D40.C
N$143: C129.1 U$16.52(RBOOS2)
N$144: R147.2 U41.1(OUT_A)
N$145: C130.1 U$16.53(RIN)
N$146: C131.1 U$16.55(RCUT2)
N$147: C132.1 U$16.59(LCUT1)
N$148: C133.1 U$16.60(LIN)
N$149: C134.1 U$16.62(LBOOS1)
N$150: C135.1 U$16.63(LOUT)
N$151: D44.C R70.2 U21.5(POS_B)
N$152: D38.A D39.C
N$153: C105.2 U$16.5(LLMC2)
N$154: C106.2 C120.2 U$16.8(LLMC3)
N$155: C107.2 U$16.10(LHMC2)
N$156: C108.2 C121.2 U$16.13(LHMC3)
N$157: C109.2 U$16.15(LHC2)
N$158: C110.2 C122.2 U$16.18(LHC3)
N$159: C111.2 C124.2 U$16.31(RHC3)
N$160: C112.2 U$16.34(RHC2)
N$161: R70.1 R71.2 U23.2(NEG_A)
N$162: C14.1 R78.2
N$163: C113.2 C125.2 U$16.36(RHMC3)
N$164: C114.2 U$16.39(RHMC2)
N$165: C115.2 C126.2 U$16.41(RLMC3)
N$166: C116.2 U$16.44(RLMC2)
N$167: C117.2 C127.2 U$16.46(RLC3)
N$168: C118.2 U$16.49(RLC2)
N$169: C129.2 U$16.51(RBOOS1)
N$170: C131.2 U$16.54(RCUT1)
N$171: C132.2 U$16.58(LCUT2)
N$172: C134.2 U$16.61(LBOOS2)
N$173: C104.1 U$16.2(LLC4)
N$175: C141.2 R137.2 R138.2 R139.2
N$181: R72.1 U24.1(OUT_A) U24.5(POS_B)
N$182: D41.A D42.C
N$191: R72.2 R73.2 U24.2(NEG_A)
N$211: D38.C R77.1 U23.7(OUT_B)
N$213: R115.2 R117.1 U6.1(OUT_A)
N$221: R198.2 R200.1 U15.1(OUT_A)
N$223: C143.1 R200.2
N$225: R186.1 R189.2 R193.2
N$226: R185.2 R192.1 R196.1
N$227: R187.2 R191.1 R195.1
N$228: R188.1 R190.1 R194.2
N$233: D27.C R99.1 U31.7(OUT_B)
N$244: D60.C R160.1 U43.7(OUT_B)
N$246: D62.A D63.C R154.1 R163.1 U44.3(POS_A)
N$261: D40.A D41.C R71.1 R80.1 U24.3(POS_A)
N$271: R80.2 U22.5(POS_B) U22.7(OUT_B)
N$312: R81.2 U4.5(POS_B)
N$331: R164.2 U13.5(POS_B)
N$333: C12.2 D23.C D25.A R52.2 U29.2(NEG_A)
N$344: C61.2 D56.C D58.A R144.2 U41.2(NEG_A)
N$411 [ANALOG]: C17.2 U$13.64(LLC2)
N$413: R114.2 R116.1 U6.7(OUT_B)
N$414: R50.2 U3.5(POS_B)
N$421: R197.2 R199.1 U15.7(OUT_B)
N$433: D33.A U31.1(OUT_A)
N$444: D66.A U43.1(OUT_A)
N$500: R28.1 U2.3(POS_A)
N$512: R57.1 U4.3(POS_A)
N$513: R115.1 R116.2 U6.2(NEG_A)
N$514: R46.1 U3.3(POS_A)
N$521: R198.1 R199.2 U15.2(NEG_A)
N$531: R140.1 U13.3(POS_A)
N$600: R31.1 U2.2(NEG_A)
N$611 [ANALOG]: C20.2 C34.2 U$13.8(LLMC3)
N$612: R59.1 U4.2(NEG_A)
N$614: R48.1 U3.2(NEG_A)
N$631: R142.1 U13.2(NEG_A)
N$633: R85.2 R87.2 U30.3(POS_A)
N$644: R146.2 R148.2 U42.3(POS_A)
N$700: R30.2 R32.2 U2.6(NEG_B)
N$711 [ANALOG]: C30.2 U$13.44(RLMC2)
N$712: R58.2 R60.2 U4.6(NEG_B)
N$714: R47.2 R49.2 U3.6(NEG_B)
N$731: R141.2 R143.2 U13.6(NEG_B)
N$733: R88.2 R89.1 U30.2(NEG_A)
N$744: R149.2 R150.1 U42.2(NEG_A)
N$800: C4.1 R30.1 U2.7(OUT_B)
N$812: C51.1 R58.1 U4.7(OUT_B)
N$814: C11.1 R47.1 U3.7(OUT_B)
N$831: C139.1 R141.1 U13.7(OUT_B)
N$833: R98.1 R99.2 U31.5(POS_B)
N$844: R159.1 R160.2 U43.5(POS_B)
N$912: C52.1 R82.2 U4.1(OUT_A)
N$914: C57.1 R51.2 U3.1(OUT_A)
N$931: C140.1 R165.2 U13.1(OUT_A)
N$1413: R103.2 R105.2 R112.2 R113.2 R114.1 U6.6(NEG_B)
N$1421: R186.2 R188.2 R195.2 R196.2 R197.1 U15.6(NEG_B)
N$1433: D26.A U29.7(OUT_B)
N$1444: D59.A U41.7(OUT_B)
N$1533: D33.C R92.2 U29.5(POS_B)
N$1544: D66.C R153.2 U41.5(POS_B)
N$1633: R92.1 R93.2 U31.2(NEG_A)
N$1644: R153.1 R154.2 U43.2(NEG_A)
N$1833: R94.1 U32.1(OUT_A) U32.5(POS_B)
N$1844: R155.1 U44.1(OUT_A) U44.5(POS_B)
N$1933: R94.2 R95.2 U32.2(NEG_A)
N$1944: R155.2 R156.2 U44.2(NEG_A)
N$2012: C53.2 R54.2 R55.2 R56.2
N$2111: C13.1 D35.A D36.C D43.A R64.1 R76.2
N$2133: C12.1 D24.A D25.C D32.A R86.1 R98.2
N$2144: C61.1 D57.A D58.C D65.A R147.1 R159.2
N$2611 [ANALOG]: C21.1 U$13.11(LHMC1)
N$2633: D29.A D30.C R93.1 R119.1 U32.3(POS_A)
N$2711 [ANALOG]: C22.1 U$13.12(LHMC4)
N$2733: R119.2 U30.5(POS_B) U30.7(OUT_B)
N$2744: R163.2 U42.5(POS_B) U42.7(OUT_B)
N$21111 [ANALOG]: C17.1 U$13.1(LLC1)
P0A: R25.1 R28.2 U$2.5(P0A)
P0A1: R56.1 R57.2 U$7.5(P0A)
P0A4: R45.1 R46.2 U$3.5(P0A)
P0A31: R139.1 R140.2 U$18.5(P0A)
P0A_0: R19.2 U$5.5(P0A)
P0A_1: R39.1 U$6.5(P0A)
P0A_01: R68.2 U$11.5(P0A)
P0A_03: R90.2 U$14.5(P0A)
P0A_04: R151.2 U$20.5(P0A)
P0A_11: R79.1 U$12.5(P0A)
P0A_13: R101.1 U$15.5(P0A)
P0A_14: R162.1 U$21.5(P0A)
P0B: R24.1 R34.1 U$2.7(P0B)
P0B1: R55.1 R81.1 U$7.7(P0B)
P0B4: R44.1 R50.1 U$3.7(P0B)
P0B31: R138.1 R164.1 U$18.7(P0B)
P0B_1: R38.1 U10.6(NEG_B) U$6.7(P0B)
P0B_11: R78.1 U22.6(NEG_B) U$12.7(P0B)
P0B_13: R100.1 U30.6(NEG_B) U$15.7(P0B)
P0B_14: R161.1 U42.6(NEG_B) U$21.7(P0B)
P0W: R31.2 R32.1 R35.1 U$2.6(P0W)
P0W1: R59.2 R60.1 R82.1 U$7.6(P0W)
P0W4: R48.2 R49.1 R51.1 U$3.6(P0W)
P0W31: R142.2 R143.1 R165.1 U$18.6(P0W)
P0W_0: R14.1 U$5.6(P0W)
P0W_01: R66.1 U$11.6(P0W)
P0W_03: R88.1 U$14.6(P0W)
P0W_04: R149.1 U$20.6(P0W)
PA0: R17.2 U10.1(OUT_A) U$4.8(PA0)
PA1: R29.2 U12.6(NEG_B) U$4.7(PA1)
PA01: R67.2 U22.1(OUT_A) U$10.8(PA0)
PA03: R89.2 U30.1(OUT_A) U$9.8(PA0)
PA04: R150.2 U42.1(OUT_A) U$19.8(PA0)
PA11: R74.2 U24.6(NEG_B) U$10.7(PA1)
PA13: R96.2 U32.6(NEG_B) U$9.7(PA1)
PA14: R157.2 U44.6(NEG_B) U$19.7(PA1)
PB0: R2.2 U9.3(POS_A) U$4.10(PB0)
PB1: C7.2 U12.7(OUT_B) U$4.5(PB1)
PB01: R62.2 U21.3(POS_A) U$10.10(PB0)
PB03: R53.2 U29.3(POS_A) U$9.10(PB0)
PB04: R145.2 U41.3(POS_A) U$19.10(PB0)
PB11: C15.2 U24.7(OUT_B) U$10.5(PB1)
PB13: C54.2 U32.7(OUT_B) U$9.5(PB1)
PB14: C70.2 U44.7(OUT_B) U$19.5(PB1)
RS: U$4.11(~RS)
RS1: U$10.11(~RS)
RS3: U$9.11(~RS)
RS4: U$19.11(~RS)
SCK: SCK1.1(P) U$2.2(SCK) U$3.2(SCK) U$4.2(SCK) U$5.2(SCK) U$6.2(SCK) U$7.2(SCK) U$9.2(SCK) U$10.2(SCK) U$11.2(SCK) U$12.2(SCK) U$14.2(SCK) U$15.2(SCK) U$18.2(SCK) U$19.2(SCK) U$20.2(SCK) U$21.2(SCK)
SCL: IC2.24(MC/SCL) SCL1.1(P) U7.2(SCL) U8.2(SCL) U16.2(SCL) U19.2(SCL) U20.2(SCL) U26.14(SCL) U27.2(SCL) U39.2(SCL) U40.2(SCL)
SCL_0: U26.5(SC0)
SCL_1: U26.4(SD0)
SCL_2: U26.10(SC2)
SCL_3: U26.9(SD2)
SDA: IC2.23(MOSI/SDA) SDA1.1(P) U7.3(SDA) U8.3(SDA) U16.3(SDA) U19.3(SDA) U20.3(SDA) U26.15(SDA) U27.3(SDA) U39.3(SDA) U40.3(SDA)
SDA_0: U26.7(SC1)
SDA_1: U26.6(SD1)
SDA_2: U26.12(SC3)
SDA_3: U26.11(SD3)
SDI/O: SDI/O1.1(P) U$2.3(SDI/SDO) U$3.3(SDI/SDO) U$4.3(SI) U$5.3(SDI/SDO) U$6.3(SDI/SDO) U$7.3(SDI/SDO) U$9.3(SI) U$10.3(SI) U$11.3(SDI/SDO) U$12.3(SDI/SDO) U$14.3(SDI/SDO) U$15.3(SDI/SDO) U$18.3(SDI/SDO) U$19.3(SI) U$20.3(SDI/SDO) U$21.3(SDI/SDO)
SHDN: U$4.12(~SHDN)
SHDN1: U$10.12(~SHDN)
SHDN3: U$9.12(~SHDN)
SHDN4: U$19.12(~SHDN)
VDD: 9VDD1.1(P) R19.1 R68.1 R90.1 R124.1 R126.1 R151.1 U2.8(V+) U3.8(V+) U4.8(V+) U6.8(V+) U7.1(VDD) U8.1(VDD) U8.4(A0) U9.8(V+) U10.8(V+) U11.8(V+) U12.8(V+) U13.8(V+) U15.8(V+) U16.1(VDD) U19.1(VDD) U20.1(VDD) U20.4(A0) U21.8(V+) U22.8(V+) U23.8(V+) U24.8(V+) U27.1(VDD) U27.4(A0) U28.8(V+) U29.8(V+) U30.8(V+) U31.8(V+) U32.8(V+) U39.1(VDD) U40.1(VDD) U40.4(A0) U41.8(V+) U42.8(V+) U43.8(V+) U44.8(V+) U$4.14(VDD) U$5.8(VDD) U$6.8(VDD) U$9.14(VDD) U$10.14(VDD) U$11.8(VDD) U$12.8(VDD) U$13.22(V_DD) U$14.8(VDD) U$15.8(VDD) U$16.22(V_DD) U$19.14(VDD) U$20.8(VDD) U$21.8(VDD)
VIN1: IC2.1(VINL2/VIN1M)
VIN2: IC2.3(VINL1/VIN1P)
VIN3: IC2.30(VINR3/VIN3P)
VIN4: IC2.28(VINR4/VIN3M)
VREF: C8.2 C16.2 C56.2 C71.2 R1.1 R2.1 R5.1 R20.2 R21.1 R27.1 R29.1 R39.2 R43.1 R52.1 R53.1 R54.1 R61.1 R62.1 R63.1 R69.2 R73.1 R74.1 R79.2 R85.1 R91.2 R95.1 R96.1 R101.2 R106.1 R107.2 R108.2 R109.2 R137.1 R144.1 R145.1 R146.1 R152.2 R156.1 R157.1 R162.2 R189.1 R190.2 R191.2 R192.2 U6.3(POS_A) U6.5(POS_B) U11.3(POS_A) U11.6(NEG_B) U15.3(POS_A) U15.5(POS_B) U23.3(POS_A) U23.6(NEG_B) U28.6(NEG_B) U28.7(OUT_B) U31.3(POS_A) U31.6(NEG_B) U43.3(POS_A) U43.6(NEG_B) U$2.8(VDD) U$3.8(VDD) U$5.7(P0B) U$7.8(VDD) U$11.7(P0B) U$14.7(P0B) U$18.8(VDD) U$20.7(P0B)
VSS: GND1.1(P) GND3.1(P) GND4.1(P) GND8.1(P) R33.2 R75.2 R97.2 R158.2 U7.4(A0) U7.5(GND) U7.9(EPAD) U8.5(GND) U8.9(EPAD) U9.4(V-) U10.4(V-) U11.4(V-) U12.4(V-) U16.4(A0) U16.5(GND) U16.9(EPAD) U19.4(A0) U19.5(GND) U19.9(EPAD) U20.5(GND) U20.9(EPAD) U21.4(V-) U22.4(V-) U23.4(V-) U24.4(V-) U27.5(GND) U27.9(EPAD) U29.4(V-) U30.4(V-) U31.4(V-) U32.4(V-) U39.4(A0) U39.5(GND) U39.9(EPAD) U40.5(GND) U40.9(EPAD) U41.4(V-) U42.4(V-) U43.4(V-) U44.4(V-) U$4.4(VSS) U$5.4(VSS) U$6.4(VSS) U$9.4(VSS) U$10.4(VSS) U$11.4(VSS) U$12.4(VSS) U$14.4(VSS) U$15.4(VSS) U$19.4(VSS) U$20.4(VSS) U$21.4(VSS)
Unconnected: IC2.2(VINR2/VIN2M) IC2.4(VINR1/VIN2P) IC2.5(MIC_BIAS) IC2.9(XO) IC2.10(XI) IC2.19(GPIO3/INTC) IC2.20(GPIO1/INTB/DMCLK) IC2.21(GPIO1/INTA/DMIN) IC2.22(MISO/GPIO0/DMIN2) IC2.25(MS/AD) IC2.26(MD0) IC2.27(VINL4/VIN4M) IC2.29(VINL3/VIN4P) U7.7(W) U8.7(W) U16.7(W) U19.7(W) U20.7(W) U27.7(W) U39.7(W) U40.7(W) U$4.6(PW1) U$4.9(PW0) U$4.13(SO) U$6.6(P0W) U$9.6(PW1) U$9.9(PW0) U$9.13(SO) U$10.6(PW1) U$10.9(PW0) U$10.13(SO) U$12.6(P0W) U$13.20(NC) U$13.24(NC) U$13.29(NC) U$13.56(NC) U$13.57(NC) U$15.6(P0W) U$16.20(NC) U$16.24(NC) U$16.29(NC) U$16.56(NC) U$16.57(NC) U$19.6(PW1) U$19.9(PW0) U$19.13(SO) U$21.6(P0W)

## Library data of the parts
3V3_D1 9VDD1 BCK_ADC1 CE_EQ1 CE_EQ2 CL_EQ1 CL_EQ2 CLK_ADC1 CS3-CS5 DI_EQ1 DI_EQ2 DOUT_ADC1 GND5 GND7 LRCK_ADC1 MUX2 MUX3 SCK1 SCL1 SDA1 SDI/O1 = wirepad:SMD2: SMD PAD
AIN1-AIN3 AIN5 AOUT1 AOUT2 GND1-GND4 GND6 GND8 = wirepad:SMD5: SMD PAD
C4-C58 C61-C71 C103-C135 C139-C141 C143 = rcl:C-US: CAPACITOR, American symbol; SPICEPREFIX: C
D6 D13-D44 D56-D66 = 1N4148W-TP:1N4148W-TP: Check availability <https://pricing.snapeda.com/parts/1N4148W-TP/Micro%20Commercial/view-part?ref=eda>; AVAILABILITY: In Stock; CHECK_PRICES: https://www.snapeda.com/parts/1N4148W-TP/Micro+Commercial+Components/view-part/?ref=eda; DESCRIPTION: 1N4148W Series 100 V 150 mA 4 ns SMT High Speed Switching Diode - SOD-123; MF: Micro Commercial; MP: 1N4148W-TP; PACKAGE: SOD-123 Multicomp; PRICE: None; PURCHASE-URL: https://www.snapeda.com/api/url_track_click_mouser/?unipart_id=9224&manufacturer=Micro Commercial&part_name=1N4148W-TP&search_term=1n4148 surface mount; SNAPEDA_LINK: https://www.snapeda.com/parts/1N4148W-TP/Micro+Commercial+Components/view-part/?ref=snap
IC2 = PCM1865DBT:PCM1865DBT: CS item no.: CS description: PCM186x 4-Channel or 2-Channel, 192-kHz, Audio ADCs Specification: http://www.ti.com Check availability <https://pricing.snapeda.com/parts/PCM1865DBT/Texas%20Instruments/view-part?ref=eda>; AVAILABILITY: In Stock; CHECK_PRICES: https://www.snapeda.com/parts/PCM1865DBT/Texas+Instruments/view-part/?ref=eda; DESCRIPTION: 110dB 4-Channel Software-Controlled Audio ADC With Universal Front End; MF: Texas Instruments; MP: PCM1865DBT; PACKAGE: TSSOP-30 Texas Instruments; PRICE: None; PURCHASE-URL: https://www.snapeda.com/api/url_track_click_mouser/?unipart_id=554870&manufacturer=Texas Instruments&part_name=PCM1865DBT&search_term=pcm186; SNAPEDA_LINK: https://www.snapeda.com/parts/PCM1865DBT/Texas+Instruments/view-part/?ref=snap
R1 R2 R5 R12-R14 R17 R19-R121 R123-R126 R137-R167 R185-R201 = rcl:R-US_: RESISTOR, American symbol; SPICEPREFIX: R
U2-U4 U6 U9-U13 U15 U21-U24 U28-U32 U41-U44 = LM4562MAX_NOPB:LM4562MAX/NOPB: Check availability <https://pricing.snapeda.com/parts/LM4562MAX/NOPB/Texas%20Instruments/view-part?ref=eda>; AVAILABILITY: In Stock; CHECK_PRICES: https://www.snapeda.com/parts/LM4562MAX/NOPB/Texas+Instruments/view-part/?ref=eda; DESCRIPTION: 2-channel, 55-MHz, high-fidelity, high performance audio op amp; MF: Texas Instruments; MP: LM4562MAX/NOPB; PACKAGE: SOIC-8 Texas Instruments; PRICE: None; PURCHASE-URL: https://www.snapeda.com/api/url_track_click_mouser/?unipart_id=21165&manufacturer=Texas Instruments&part_name=LM4562MAX/NOPB&search_term=lm4562; SNAPEDA_LINK: https://www.snapeda.com/parts/LM4562MAX/NOPB/Texas+Instruments/view-part/?ref=snap
U7 U8 U16 U19 U20 U27 U39 U40 = MAX5419LETA_:MAX5419LETA+: Check availability <https://pricing.snapeda.com/parts/MAX5419LETA%2B/Analog%20Devices/view-part?ref=eda>; AVAILABILITY: In Stock; CHECK_PRICES: https://www.snapeda.com/parts/MAX5419LETA+/Analog+Devices/view-part/?ref=eda; DESCRIPTION: 256-Tap, Nonvolatile, I²C-Interface, Digital Potentiometers; MF: Analog Devices; MP: MAX5419LETA+; PACKAGE: TDFN-EP-8 Maxim; PRICE: None; PURCHASE-URL: https://www.snapeda.com/api/url_track_click_mouser/?unipart_id=895758&manufacturer=Analog Devices&part_name=MAX5419LETA+&search_term=max541; SNAPEDA_LINK: https://www.snapeda.com/parts/MAX5419LETA+/Analog+Devices/view-part/?ref=snap
U17 U18 U25 = TMUX1204DGSR:TMUX1204DGSR: Check availability <https://pricing.snapeda.com/parts/TMUX1204DGSR/Texas%20Instruments/view-part?ref=eda>; AVAILABILITY: In Stock; CHECK_PRICES: https://www.snapeda.com/parts/TMUX1204DGSR/Texas+Instruments/view-part/?ref=eda; DESCRIPTION: 5-V, 4:1, 1-channel, general-purpose analog multiplexer; MF: Texas Instruments; MP: TMUX1204DGSR; PACKAGE: VSSOP-10 Texas Instruments; PRICE: None; PURCHASE-URL: https://www.snapeda.com/api/url_track_click_mouser/?unipart_id=3657556&manufacturer=Texas Instruments&part_name=TMUX1204DGSR&search_term=tmux1204; SNAPEDA_LINK: https://www.snapeda.com/parts/TMUX1204DGSR/Texas+Instruments/view-part/?ref=snap
U26 = TCA9546ADR:TCA9546ADR: Check availability <https://pricing.snapeda.com/parts/TCA9546ADR/Texas%20Instruments/view-part?ref=eda>; AVAILABILITY: In Stock; CHECK_PRICES: https://www.snapeda.com/parts/TCA9546ADR/Texas+Instruments/view-part/?ref=eda; DESCRIPTION: 4-channel 1.65- to 5.5-V I2C/SMBus switch with reset & voltage translation; MF: Texas Instruments; MP: TCA9546ADR; PACKAGE: SOIC-16 Texas Instruments; PRICE: None; PURCHASE-URL: https://www.snapeda.com/api/url_track_click_mouser/?unipart_id=424331&manufacturer=Texas Instruments&part_name=TCA9546ADR&search_term=None; SNAPEDA_LINK: https://www.snapeda.com/parts/TCA9546ADR/Texas+Instruments/view-part/?ref=snap
U$2 U$3 U$7 U$18 = MCP4131-503E_SN:MCP4131-503E/SN: Check availability <https://pricing.snapeda.com/parts/MCP4131-503E/SN/Microchip/view-part?ref=eda>; AVAILABILITY: In Stock; CHECK_PRICES: https://www.snapeda.com/parts/MCP4131-503E/SN/Microchip/view-part/?ref=eda; DESCRIPTION: MCP4131-503E/SN,Digi Potentiometer 50kOhm 129-Pos Linear Serial-SPI 8-Pin SOIC | Microchip Technology Inc. MCP4131-503E/SN; MF: Microchip; MP: MCP4131-503E/SN; PACKAGE: SOIC-8 Microchip; PRICE: None; PURCHASE-URL: https://www.snapeda.com/api/url_track_click_mouser/?unipart_id=129576&manufacturer=Microchip&part_name=MCP4131-503E/SN&search_term=mcp413; SNAPEDA_LINK: https://www.snapeda.com/parts/MCP4131-503E/SN/Microchip/view-part/?ref=snap; SPICEPREFIX: X
U$4 U$9 U$10 U$19 = MCP42100-I_P:MCP42100-I/P: Digital Potentiometer Check availability <https://pricing.snapeda.com/parts/MCP42100-I/P/Microchip/view-part?ref=eda>; AVAILABILITY: In Stock; CHECK_PRICES: https://www.snapeda.com/parts/MCP42100-I/P/Microchip/view-part/?ref=eda; DESCRIPTION: Pot,Digital;Rest 100 Kilohms;Digital;256 Pos;14 Pins;2 Ch;Pkg DIP | Microchip Technology Inc. MCP42100-I/P; MF: Microchip; MP: MCP42100-I/P; PACKAGE: DIP-14 Microchip; PRICE: None; PURCHASE-URL: https://www.snapeda.com/api/url_track_click_mouser/?unipart_id=40874&manufacturer=Microchip&part_name=MCP42100-I/P&search_term=mcp42100; SNAPEDA_LINK: https://www.snapeda.com/parts/MCP42100-I/P/Microchip/view-part/?ref=snap
U$5 U$6 U$11 U$12 U$14 U$15 U$20 U$21 = MCP4131-503E_SN:MCP4131-503E/SN: Check availability <https://pricing.snapeda.com/parts/MCP4131-503E/SN/Microchip/view-part?ref=eda>; AVAILABILITY: In Stock; CHECK_PRICES: https://www.snapeda.com/parts/MCP4131-503E/SN/Microchip/view-part/?ref=eda; DESCRIPTION: MCP4131-503E/SN,Digi Potentiometer 50kOhm 129-Pos Linear Serial-SPI 8-Pin SOIC | Microchip Technology Inc. MCP4131-503E/SN; MF: Microchip; MP: MCP4131-503E/SN; PACKAGE: SOIC-8 Microchip; PRICE: None; PURCHASE-URL: https://www.snapeda.com/api/url_track_click_mouser/?unipart_id=129576&manufacturer=Microchip&part_name=MCP4131-503E/SN&search_term=mcp413; SNAPEDA_LINK: https://www.snapeda.com/parts/MCP4131-503E/SN/Microchip/view-part/?ref=snap
U$13 U$16 = LC75281E:LC75281E

## Net classes
4 ANALOG: width 0.508 mm, drill 0.508 mm, clearance 0.254 mm